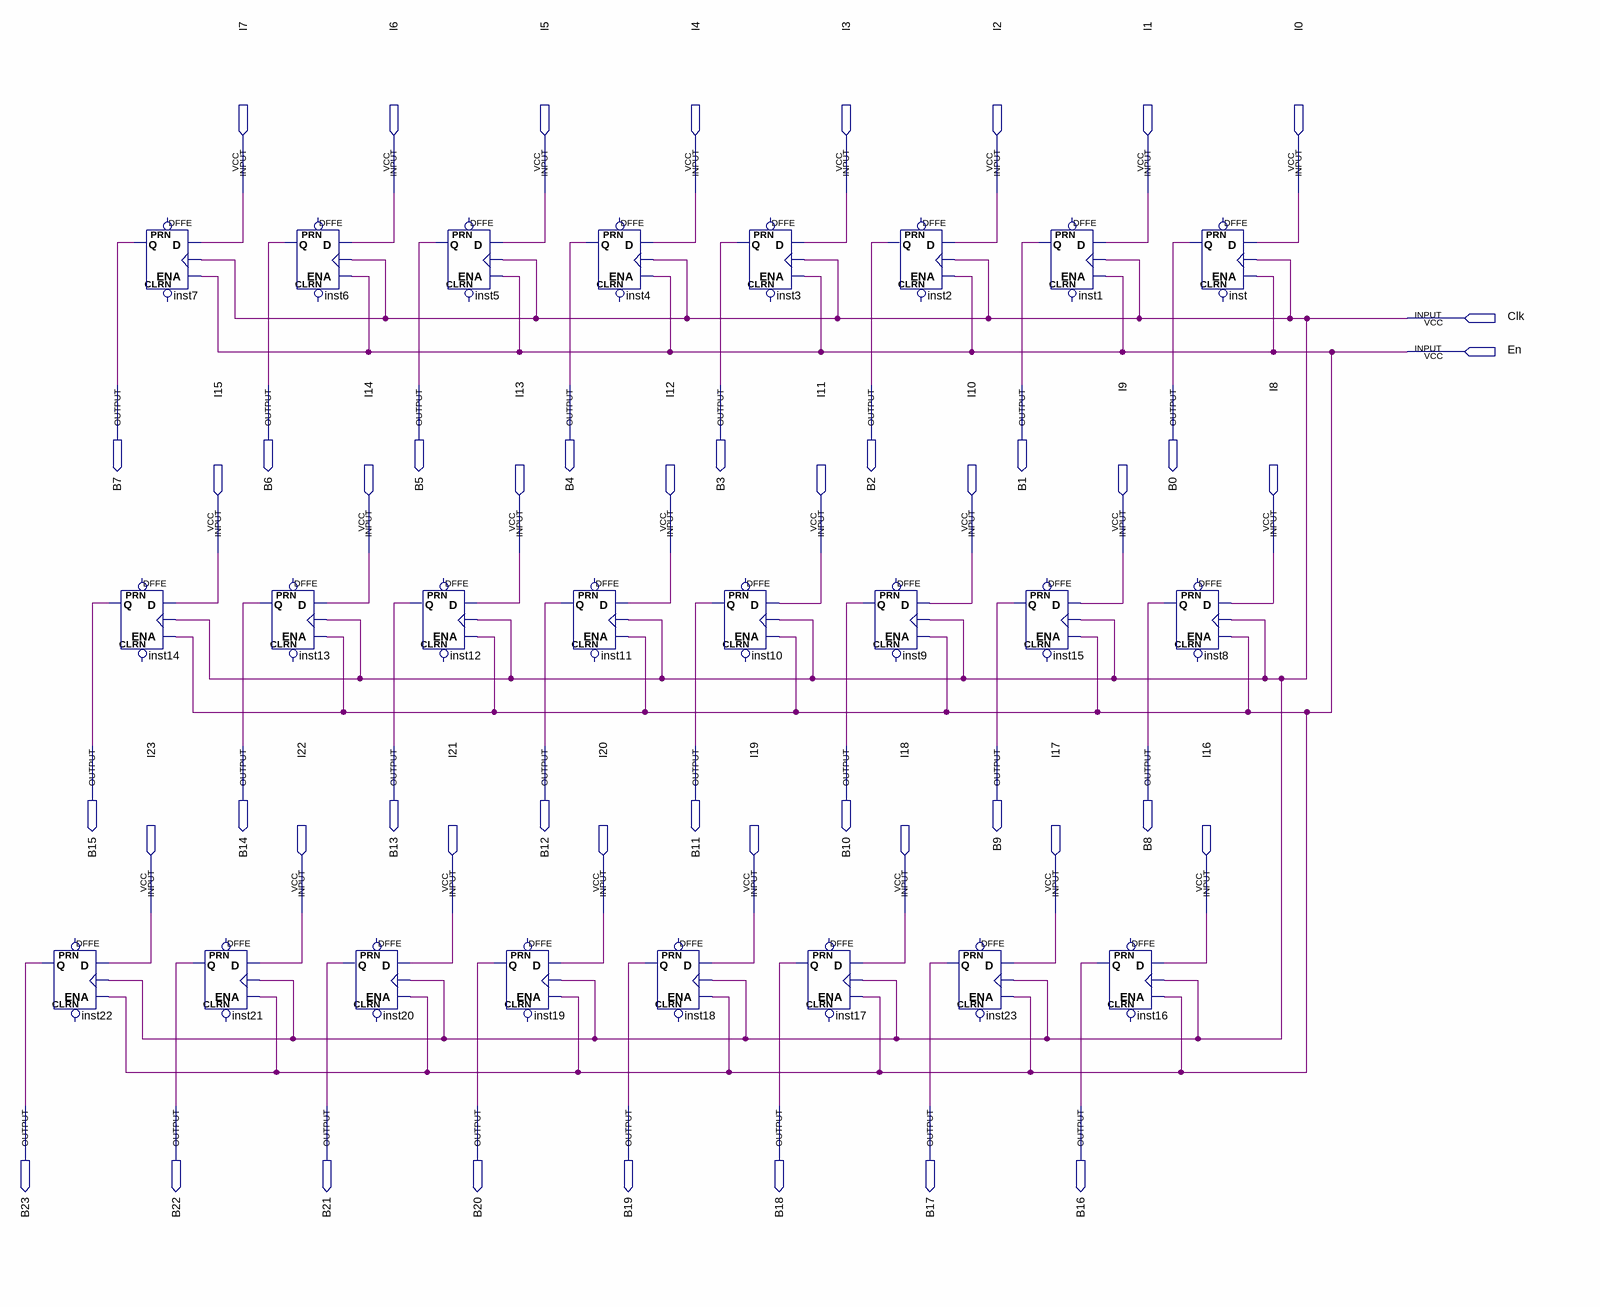
[diagram p0: schematic sheet]
// Quartus schematic 24_bit_parallel_reg.bdf as structural Verilog: 24 symbols, 50 pins
module \24_bit_parallel_reg  (
  input  I7,
  input  I6,
  input  I5,
  input  I4,
  input  I3,
  input  I2,
  input  I1,
  input  I0,
  input  Clk,
  input  En,
  input  I15,
  input  I14,
  input  I13,
  input  I12,
  input  I11,
  input  I10,
  input  I9,
  input  I8,
  input  I23,
  input  I22,
  input  I21,
  input  I20,
  input  I19,
  input  I18,
  input  I17,
  input  I16,
  output B7,
  output B6,
  output B5,
  output B4,
  output B3,
  output B2,
  output B1,
  output B0,
  output B15,
  output B14,
  output B13,
  output B12,
  output B11,
  output B10,
  output B9,
  output B8,
  output B23,
  output B22,
  output B21,
  output B20,
  output B19,
  output B18,
  output B17,
  output B16
);

  DFFE inst22 (.D(I23), .CLK(Clk), .ENA(En), .Q(B23));  // open: PRN, CLRN
  DFFE inst7 (.D(I7), .CLK(Clk), .ENA(En), .Q(B7));  // open: PRN, CLRN
  DFFE inst14 (.D(I15), .CLK(Clk), .ENA(En), .Q(B15));  // open: PRN, CLRN
  DFFE inst21 (.D(I22), .CLK(Clk), .ENA(En), .Q(B22));  // open: PRN, CLRN
  DFFE inst6 (.D(I6), .CLK(Clk), .ENA(En), .Q(B6));  // open: PRN, CLRN
  DFFE inst13 (.D(I14), .CLK(Clk), .ENA(En), .Q(B14));  // open: PRN, CLRN
  DFFE inst20 (.D(I21), .CLK(Clk), .ENA(En), .Q(B21));  // open: PRN, CLRN
  DFFE inst5 (.D(I5), .CLK(Clk), .ENA(En), .Q(B5));  // open: PRN, CLRN
  DFFE inst12 (.D(I13), .CLK(Clk), .ENA(En), .Q(B13));  // open: PRN, CLRN
  DFFE inst19 (.D(I20), .CLK(Clk), .ENA(En), .Q(B20));  // open: PRN, CLRN
  DFFE inst11 (.D(I12), .CLK(Clk), .ENA(En), .Q(B12));  // open: PRN, CLRN
  DFFE inst4 (.D(I4), .CLK(Clk), .ENA(En), .Q(B4));  // open: PRN, CLRN
  DFFE inst18 (.D(I19), .CLK(Clk), .ENA(En), .Q(B19));  // open: PRN, CLRN
  DFFE inst3 (.D(I3), .CLK(Clk), .ENA(En), .Q(B3));  // open: PRN, CLRN
  DFFE inst10 (.D(I11), .CLK(Clk), .ENA(En), .Q(B11));  // open: PRN, CLRN
  DFFE inst17 (.D(I18), .CLK(Clk), .ENA(En), .Q(B18));  // open: PRN, CLRN
  DFFE inst2 (.D(I2), .CLK(Clk), .ENA(En), .Q(B2));  // open: PRN, CLRN
  DFFE inst9 (.D(I10), .CLK(Clk), .ENA(En), .Q(B10));  // open: PRN, CLRN
  DFFE inst23 (.D(I17), .CLK(Clk), .ENA(En), .Q(B17));  // open: PRN, CLRN
  DFFE inst1 (.D(I1), .CLK(Clk), .ENA(En), .Q(B1));  // open: PRN, CLRN
  DFFE inst15 (.D(I9), .CLK(Clk), .ENA(En), .Q(B9));  // open: PRN, CLRN
  DFFE inst16 (.D(I16), .CLK(Clk), .ENA(En), .Q(B16));  // open: PRN, CLRN
  DFFE inst8 (.D(I8), .CLK(Clk), .ENA(En), .Q(B8));  // open: PRN, CLRN
  DFFE inst (.D(I0), .CLK(Clk), .ENA(En), .Q(B0));  // open: PRN, CLRN
endmodule
